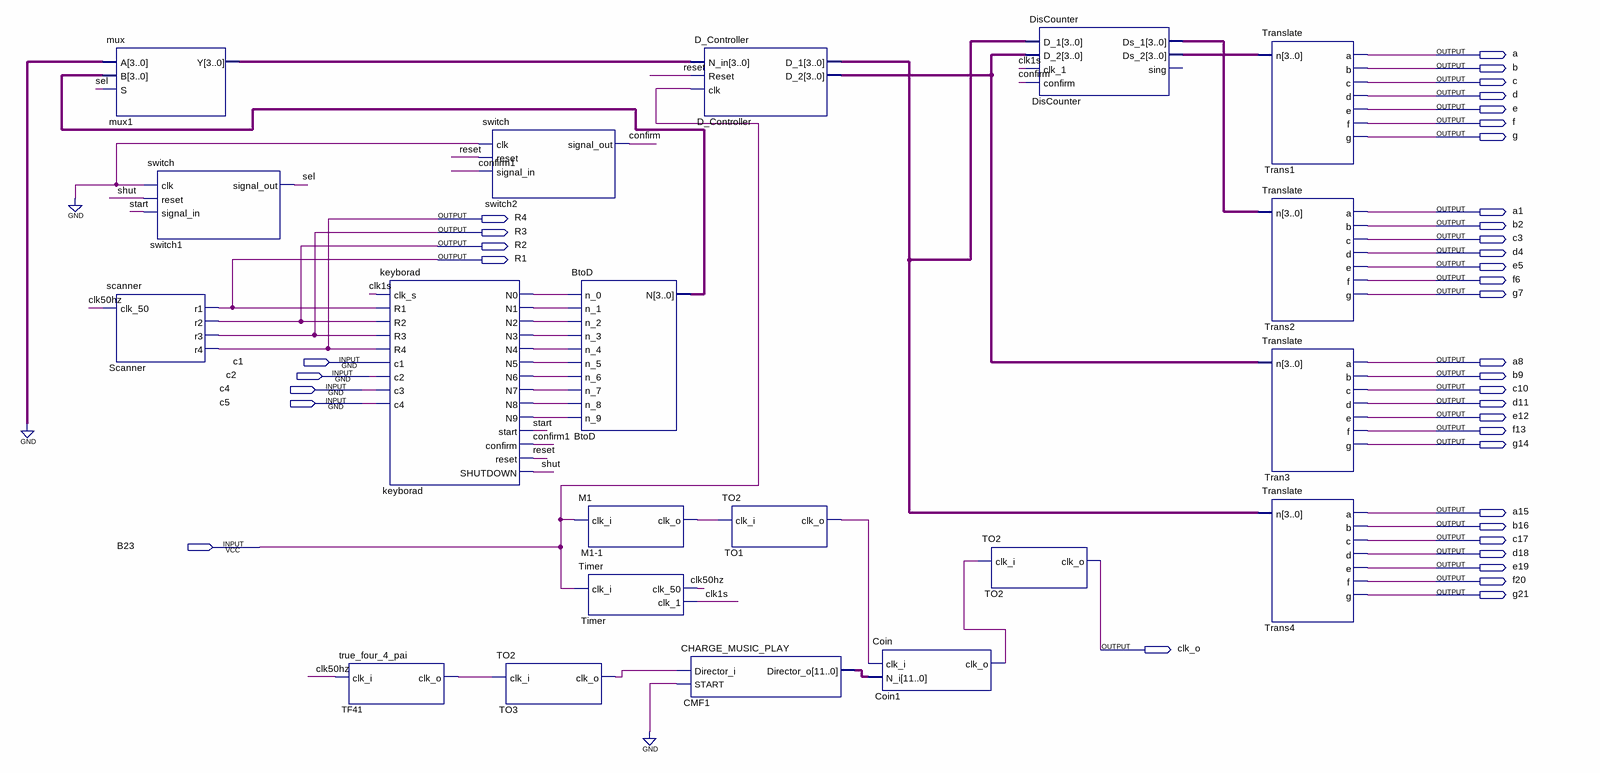
[diagram p0: schematic sheet]
// Quartus schematic CoinCharger.bdf as structural Verilog: 20 symbols, 38 pins
module CoinCharger (
  input  c1,
  input  c2,
  input  c4,
  input  c5,
  input  B23,
  output a,
  output b,
  output c,
  output d,
  output e,
  output f,
  output g,
  output a1,
  output R4,
  output b2,
  output R3,
  output c3,
  output R2,
  output d4,
  output R1,
  output e5,
  output f6,
  output g7,
  output a8,
  output b9,
  output c10,
  output d11,
  output e12,
  output f13,
  output g14,
  output a15,
  output b16,
  output c17,
  output d18,
  output e19,
  output f20,
  output g21,
  output clk_o
);

  wire clk1s, clk50hz, Coin1_clk_o, confirm, confirm1, keyborad_n0, keyborad_n1, keyborad_n2, keyborad_n3,
       keyborad_n4, keyborad_n5, keyborad_n6, keyborad_n7, keyborad_n8, keyborad_n9, M1_1_clk_o, reset, sel,
       shut, start, TF41_clk_o, TO1_clk_o, TO3_clk_o;
  wire [3:0] BtoD_n, D_Controller_d_1, D_Controller_d_2, DisCounter_ds_1, DisCounter_ds_2, mux1_y;
  wire [11:0] CMF1_director_o;

  mux mux1 (.A(4'b0000), .B(BtoD_n), .S(sel), .Y(mux1_y));
  scanner Scanner (.clk_50(clk50hz), .r1(R1), .r2(R2), .r3(R3), .r4(R4));
  switch switch1 (.clk(1'b0), .reset(shut), .signal_in(start), .signal_out(sel));
  true_four_4_pai TF41 (.clk_i(clk50hz), .clk_o(TF41_clk_o));
  keyborad keyborad (
    .clk_s(clk1s), .R1(R1), .R2(R2), .R3(R3), .R4(R4), .c1(c1), .c2(c2), .c3(c4), .c4(c5), .N0(keyborad_n0),
    .N1(keyborad_n1), .N2(keyborad_n2), .N3(keyborad_n3), .N4(keyborad_n4), .N5(keyborad_n5),
    .N6(keyborad_n6), .N7(keyborad_n7), .N8(keyborad_n8), .N9(keyborad_n9), .start(start),
    .confirm(confirm1), .reset(reset), .SHUTDOWN(shut));
  switch switch2 (.clk(1'b0), .reset(reset), .signal_in(confirm1), .signal_out(confirm));
  TO2 TO3 (.clk_i(TF41_clk_o), .clk_o(TO3_clk_o));
  BtoD BtoD (
    .n_0(keyborad_n0), .n_1(keyborad_n1), .n_2(keyborad_n2), .n_3(keyborad_n3), .n_4(keyborad_n4),
    .n_5(keyborad_n5), .n_6(keyborad_n6), .n_7(keyborad_n7), .n_8(keyborad_n8), .n_9(keyborad_n9), .N(BtoD_n));
  M1 \M1-1  (.clk_i(B23), .clk_o(M1_1_clk_o));
  Timer Timer (.clk_i(B23), .clk_50(clk50hz), .clk_1(clk1s));
  CHARGE_MUSIC_PLAY CMF1 (.Director_i(TO3_clk_o), .START(1'b0), .Director_o(CMF1_director_o));
  D_Controller D_Controller (.N_in(mux1_y), .Reset(reset), .clk(B23), .D_1(D_Controller_d_1), .D_2(D_Controller_d_2));
  TO2 TO1 (.clk_i(M1_1_clk_o), .clk_o(TO1_clk_o));
  Coin Coin1 (.clk_i(TO1_clk_o), .N_i(CMF1_director_o), .clk_o(Coin1_clk_o));
  TO2 TO2 (.clk_i(Coin1_clk_o), .clk_o(clk_o));
  DisCounter DisCounter (
    .D_1(D_Controller_d_1), .D_2(D_Controller_d_2), .clk_1(clk1s), .confirm(confirm), .Ds_1(DisCounter_ds_1),
    .Ds_2(DisCounter_ds_2));  // open: sing
  Translate Trans1 (.n(DisCounter_ds_2), .a(a), .b(b), .c(c), .d(d), .e(e), .f(f), .g(g));
  Translate Trans2 (.n(DisCounter_ds_1), .a(a1), .b(b2), .c(c3), .d(d4), .e(e5), .f(f6), .g(g7));
  Translate Tran3 (.n(D_Controller_d_2), .a(a8), .b(b9), .c(c10), .d(d11), .e(e12), .f(f13), .g(g14));
  Translate Trans4 (.n(D_Controller_d_1), .a(a15), .b(b16), .c(c17), .d(d18), .e(e19), .f(f20), .g(g21));
endmodule
